# Altium schematic sheet Uc_Ticketing_Slave.SchDoc
size A4; Author: Mario Dos Santos; Organization: ETML-ES; Address1: Avenue Recordon 1; Address2: 1004 Lausanne; Address3: Switzerland; SheetNumber: 3; SheetTotal: 5
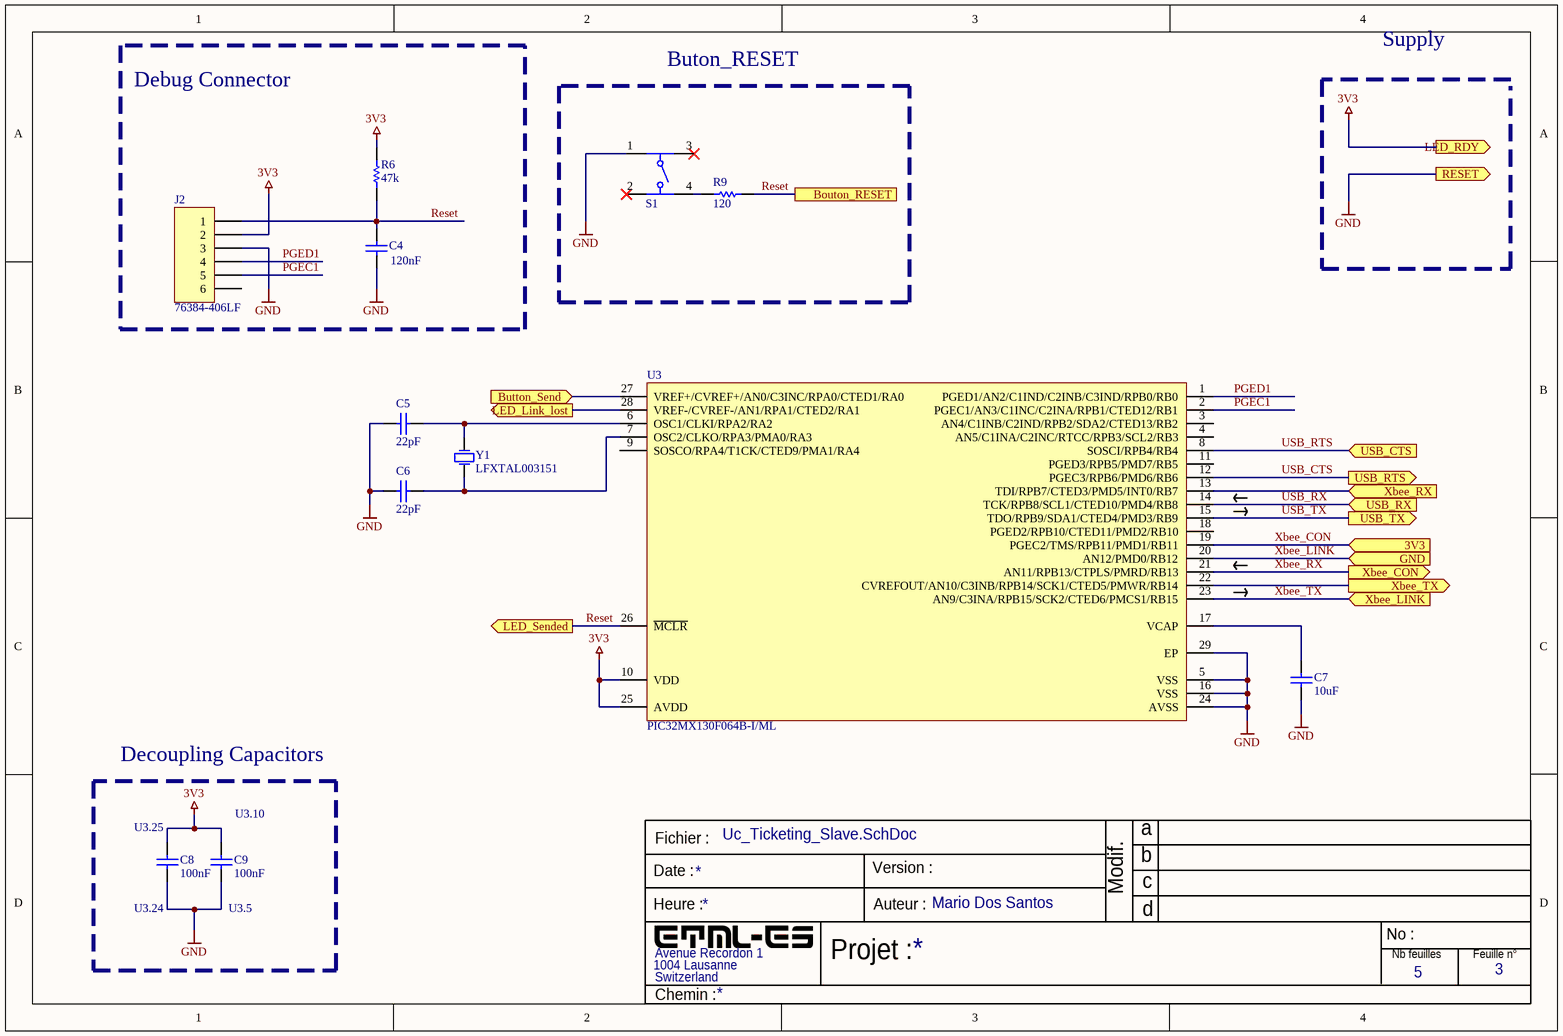
[diagram p0: Uc_Ticketing_Slave.SchDoc]

## Parts
C4  120nF  [6-0805_N]
C5  22pF  [6-0805_N]
C6  22pF  [6-0805_N]
C7  10uF  [6-0805_N]
C8  100nF  [6-0805_N]
C9  100nF  [6-0805_N]
J2  76384-406LF  [76384-406LF]
R6  47k  [RESC0805(2012)_L]
R9  120  [RESC0805(2012)_L]
S1  430182050816  [430182050816]  (value not drawn)
U3  PIC32MX130F064B-I/ML  [MCHP-QFN-ML28_L]
Y1  LFXTAL003151  [LFXTAL003151REEL]

## Blocks framed on the sheet
Debug Connector: C4 J2 R6
Buton_RESET: R9 S1
Decoupling Capacitors: C8 C9

## Ports
3V3 (in), Bouton_RESET, Button_Send (in), GND (in), LED_Link_lost (out), LED_RDY (out), LED_Sended (out), RESET (out), USB_CTS (in), USB_RTS (out), USB_RX (in), USB_TX (out), Xbee_CON (out), Xbee_LINK (in), Xbee_RX (in), Xbee_TX (out)

## Nets
3V3: C8.2 C9.2 J2.2 R6.1 U3.10(VDD) U3.25(AVDD) ; port LED_RDY
GND: C4.1 C5.1 C6.1 C7.1 C8.1 C9.1 J2.3 S1.1 U3.5(VSS) U3.16(VSS) U3.24(AVSS) U3.29(EP) ; port RESET
Button_Send: U3.27(VREF+/CVREF+/AN0/C3INC/RPA0/CTED1/RA0) ; port Button_Send
LED_Link_lost: U3.28(VREF-/CVREF-/AN1/RPA1/CTED2/RA1) ; port LED_Link_lost
PGEC1: J2.5 U3.2(PGEC1/AN3/C1INC/C2INA/RPB1/CTED12/RB1)
PGED1: J2.4 U3.1(PGED1/AN2/C1IND/C2INB/C3IND/RPB0/RB0)
Reset: C4.2 J2.1 R6.2 R9.2 U3.26(~{MCLR}) ; port LED_Sended, port Bouton_RESET
USB_CTS: U3.12(PGEC3/RPB6/PMD6/RB6) ; port USB_RTS
USB_RTS: U3.8(SOSCI/RPB4/RB4) ; port USB_CTS
USB_RX: U3.14(TCK/RPB8/SCL1/CTED10/PMD4/RB8) ; port USB_RX
USB_TX: U3.15(TDO/RPB9/SDA1/CTED4/PMD3/RB9) ; port USB_TX
Xbee_CON: U3.19(PGEC2/TMS/RPB11/PMD1/RB11) ; port 3V3
Xbee_LINK: U3.20(AN12/PMD0/RB12) ; port GND
Xbee_RX: U3.13(TDI/RPB7/CTED3/PMD5/INT0/RB7) ; port Xbee_RX
Xbee_RX: U3.21(AN11/RPB13/CTPLS/PMRD/RB13) ; port Xbee_CON  [a separate net that carries the same name]
Xbee_TX: U3.22(CVREFOUT/AN10/C3INB/RPB14/SCK1/CTED5/PMWR/RB14) ; port Xbee_TX
Xbee_TX: U3.23(AN9/C3INA/RPB15/SCK2/CTED6/PMCS1/RB15) ; port Xbee_LINK  [a separate net that carries the same name]
NetC5_2: C5.2 U3.6(OSC1/CLKI/RPA2/RA2) Y1.1
NetC6_2: C6.2 U3.7(OSC2/CLKO/RPA3/PMA0/RA3) Y1.2
NetC7_2: C7.2 U3.17(VCAP)
NetR9_1: R9.1 S1.4

Not connected (* = marked no-connect by the designer): J2 6; S1 2* 3*; U3 3(AN4/C1INB/C2IND/RPB2/SDA2/CTED13/RB2) 4(AN5/C1INA/C2INC/RTCC/RPB3/SCL2/RB3) 9(SOSCO/RPA4/T1CK/CTED9/PMA1/RA4) 11(PGED3/RPB5/PMD7/RB5) 18(PGED2/RPB10/CTED11/PMD2/RB10)

## Notes on the sheet
- Supply
- (near C8) U3.25
- (near C9) U3.10
- (near C8) U3.24
- (near C9) U3.5
- Fichier :
- a
- Date :
- Heure :
- Version :
- Auteur :
- Modif.
- b
- c
- d
- Projet :
- No :
- Nb feuilles
- Feuille n°
- Chemin :

## Library data of the parts
C4 C7-C9 = Cap: Capacitor; Supplier: Digi-Key
  C4: Value: 120nF; Supplier Part Number: 311-4323-1-ND; Supplier unit price: 0.18
  C7: Value: 10uF; Supplier Part Number: 1276-1298-1-ND; Supplier unit price: 0.1
  C8 C9: Value: 100nF; Supplier Part Number: 399-C0805C104M5RAC7800CT-ND; Supplier unit price: 0.1
C5 C6 = CMP-2007-03167-1: VJ0805Y104KNAAT; Supplier: Digi-Key; Supplier Part Number: 399-C0805C220J5GAC7800CT-ND; Supplier unit price: 0.1; Value: 22pF
J2 = Header 6: Header, 6-Pin; LatestRevisionDate: 17-Jul-2002; LatestRevisionNote: Re-released for DXP Platform.; Publisher: Altium Limited; Supplier 1: Digi-Key; Supplier Part Number 1: 609-1321-ND; Supplier unit price: 0.66; Value: 76384-406LF
R6 = CMP-1013-00122-1: 100K 0.125W 5% 0805 (2012 Metric)  SMD; Value: 47k; Supplier: Digi-Key; Supplier Part Number: A130144CT-ND; Supplier unit price: 0.1
R9 = CMP-1013-00122-1: 100K 0.125W 5% 0805 (2012 Metric)  SMD; Value: 10k; Supplier: Digi-Key; Supplier Part Number: A129738CT-ND; Supplier unit price: 0.1
S1 = 430182050816: 6x6mm SMD Tact Switch WS-TASV, height 5 mm, 160 gf; Supplier: Digi-Key; Supplier Part Number: 732-7005-1-ND; Supplier unit price: 0.51; Value: 430182050816
U3 = CMP-0048-00437-1: 32-bit Microcontroller with Audio and Graphics Interface, USB and Advanced Analog, 40 MHz, 21 I/O, PMP, -40 to 85 degC, 28-pin QFN (ML28), Tube; Supplier: Digi-Key; Supplier Part Number: PIC32MX130F064B-I/ML; Supplier unit price: 3.61; Value: PIC32MX130F064B-I/ML
Y1 = LFXTAL003151REEL: Crystal or Oscillator; Frequency: 8MHz; Supplier: Farnell; Supplier Part Number: 9713794; Supplier unit price: 0.392; Value: LFXTAL003151